# Altium project shoot2.PrjPcb
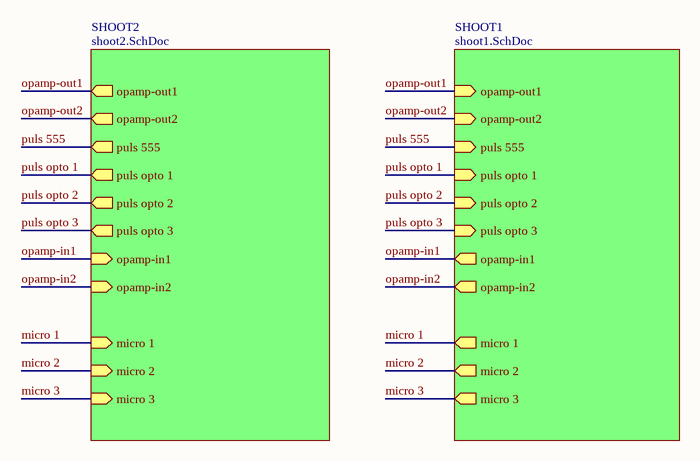
[diagram p0: mainsheet.SchDoc]
3 sheets, 80 parts. Net scope: hierarchical (ports join the sheet entries above them; power ports are global).
Board file: PCB1.PcbDoc
Sheets:
  mainsheet.SchDoc
    SHOOT2 = shoot2.SchDoc
    SHOOT1 = shoot1.SchDoc

## Sheet mainsheet.SchDoc
size A

### Sub-sheets
SHOOT1 = shoot1.SchDoc: opamp-out1 (in), opamp-out2 (in), puls 555 (in), puls opto 1 (in), puls opto 2 (in), puls opto 3 (in), opamp-in1 (out), opamp-in2 (out), micro 1 (out), micro 2 (out), micro 3 (out)
SHOOT2 = shoot2.SchDoc: opamp-out1 (out), opamp-out2 (out), puls 555 (out), puls opto 1 (out), puls opto 2 (out), puls opto 3 (out), opamp-in1 (in), opamp-in2 (in), micro 1 (in), micro 2 (in), micro 3 (in)

### Nets
micro 1: sheet SHOOT2/micro 1, sheet SHOOT1/micro 1
micro 2: sheet SHOOT2/micro 2, sheet SHOOT1/micro 2
micro 3: sheet SHOOT2/micro 3, sheet SHOOT1/micro 3
opamp-in1: sheet SHOOT2/opamp-in1, sheet SHOOT1/opamp-in1
opamp-in2: sheet SHOOT2/opamp-in2, sheet SHOOT1/opamp-in2
opamp-out1: sheet SHOOT2/opamp-out1, sheet SHOOT1/opamp-out1
opamp-out2: sheet SHOOT2/opamp-out2, sheet SHOOT1/opamp-out2
puls 555: sheet SHOOT2/puls 555, sheet SHOOT1/puls 555
puls opto 1: sheet SHOOT2/puls opto 1, sheet SHOOT1/puls opto 1
puls opto 2: sheet SHOOT2/puls opto 2, sheet SHOOT1/puls opto 2
puls opto 3: sheet SHOOT2/puls opto 3, sheet SHOOT1/puls opto 3

## Sheet shoot2.SchDoc
size A
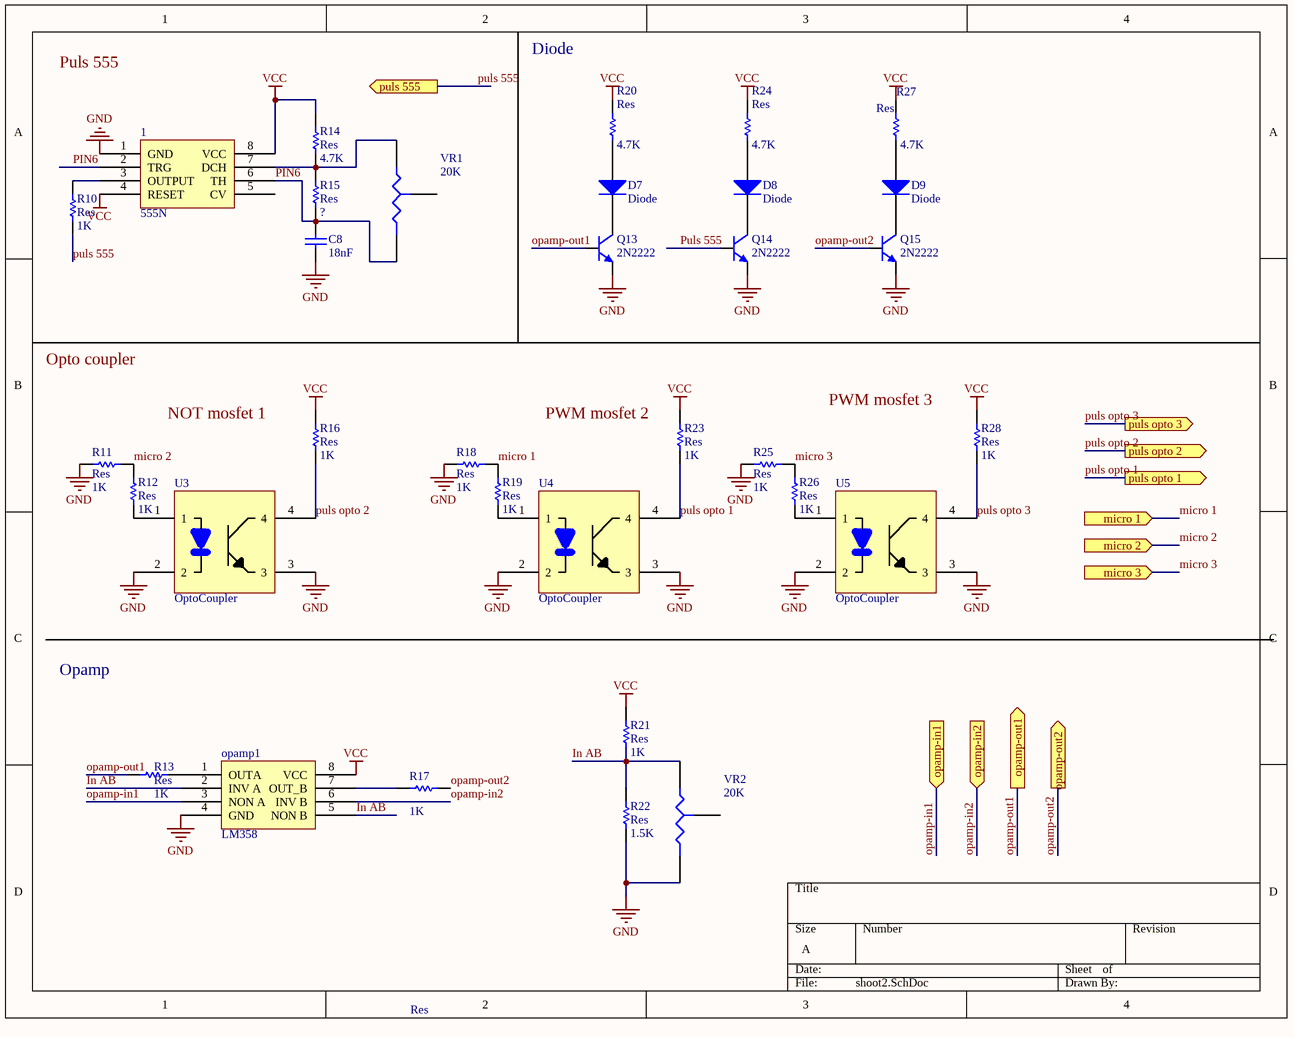
[diagram p1: shoot2.SchDoc]

### Parts
1  555N  [8 pin SOIC_N]
C8  value 18nF  [2012[0805]]  (hidden comment: Cap_UP)
D7  Diode  [2012[0805]]
D8  Diode  [2012[0805]]
D9  Diode  [2012[0805]]
opamp1  LM358  [8 pin SOIC_N]
Q13  2N2222  [SOT-23]
Q14  2N2222  [SOT-23]
Q15  2N2222  [SOT-23]
R10  Res  value 1K  [2012[0805]]
R11  Res  value 1K  [2012[0805]]
R12  Res  value 1K  [2012[0805]]
R13  Res  value 1K  [2012[0805]]
R14  Res  value 4.7K  [2012[0805]]
R15  Res  [2012[0805]]
R16  Res  value 1K  [2012[0805]]
R17  Res  value 1K  [2012[0805]]
R18  Res  value 1K  [2012[0805]]
R19  Res  value 1K  [2012[0805]]
R20  Res  value 4.7K  [2012[0805]]
R21  Res  value 1K  [2012[0805]]
R22  Res  value 1.5K  [2012[0805]]
R23  Res  value 1K  [2012[0805]]
R24  Res  value 4.7K  [2012[0805]]
R25  Res  value 1K  [2012[0805]]
R26  Res  value 1K  [2012[0805]]
R27  Res  value 4.7K  [2012[0805]]
R28  Res  value 1K  [2012[0805]]
U3  OptoCoupler  [DIP-4]
U4  OptoCoupler  [DIP-4]
U5  OptoCoupler  [DIP-4]
VR1  value 20K  [MULTITURN]  (hidden comment: Res Tap)
VR2  value 20K  [MULTITURN]  (hidden comment: Res Tap)

### Ports
micro 1 (in), micro 2 (in), micro 3 (in), opamp-in1 (in), opamp-in2 (in), opamp-out1 (out), opamp-out2 (out), puls 555 (out), puls opto 1 (out), puls opto 2 (out), puls opto 3 (out)

### Nets
GND: 1.1(GND) C8.2 opamp1.4(GND) Q13.3(E) Q14.3(E) Q15.3(E) R11.2 R18.2 R22.1 R25.2 U3.2 U3.3 U4.2 U4.3 U5.2 U5.3 VR2.2(B)
VCC: 1.4(RESET) 1.8(VCC) opamp1.8(VCC) R14.2 R16.2 R20.2 R21.2 R23.2 R24.2 R27.2 R28.2
In AB: opamp1.2(INV_A) opamp1.5(NON_B) R21.1 R22.2 VR2.1(A)
micro 1: R18.1 R19.2 ; port micro 1
micro 2: R11.1 R12.2 ; port micro 2
micro 3: R25.1 R26.2 ; port micro 3
opamp-in1: opamp1.3(NON_A) ; port opamp-in1
opamp-in2: opamp1.6(INV_B) ; port opamp-in2
opamp-out1: Q13.2(B) R13.2 ; port opamp-out1
opamp-out2: Q15.2(B) R17.1 ; port opamp-out2
PIN6: 1.2(TRG) 1.6(TH) C8.1 R15.1 VR1.2(B)
puls 555: Q14.2(B) R10.1 ; port puls 555
puls opto 1: R23.1 U4.4 ; port puls opto 1
puls opto 2: R16.1 U3.4 ; port puls opto 2
puls opto 3: R28.1 U5.4 ; port puls opto 3
Net1_3: 1.3(OUTPUT) R10.2
Net1_7: 1.7(DCH) R14.1 R15.2 VR1.1(A)
NetD7_1: D7.1(A) R20.1
NetD7_2: D7.2(K) Q13.1(C)
NetD8_1: D8.1(A) R24.1
NetD8_2: D8.2(K) Q14.1(C)
NetD9_1: D9.1(A) R27.1
NetD9_2: D9.2(K) Q15.1(C)
Netopamp1_1: opamp1.1(OUTA) R13.1
Netopamp1_7: opamp1.7(OUT_B) R17.2
NetR12_1: R12.1 U3.1
NetR19_1: R19.1 U4.1
NetR26_1: R26.1 U5.1

Not connected (* = marked no-connect by the designer): 1 5(CV); VR1 3(TAP); VR2 3(TAP)

### Notes on the sheet
- Diode
- Opamp
- Labels drawn without touching a wire or pin: NOT mosfet 1, Opto coupler, Puls 555, PWM mosfet 2, PWM mosfet 3

### Library data of the parts
1 opamp1 = 7667: Dual MOSFET Driver
C8 = Cap_UP: Capacitor; Published: 8-Jun-2000; LatestRevisionDate: 17-Jul-2002; LatestRevisionNote: Re-released for DXP Platform.; PackageReference: RAD-0.3; Publisher: Altium Limited
D7-D9 = Diode: 1 Amp General Purpose Rectifier; Revision 1: 11-Jul-2000: SIM Model Added.; Revision 2: 17-Jul-2002: Re-released for DXP Platform.; Package Information: Latest Revision: Aug-1999; Code - JEDEC: DO-204-AL; Published: 8-Jun-2000; Datasheet: Latest Revision: 1998; Package Reference: DO-41; Publisher: Altium Limited
Q13-Q15 = 2N2222: NPN Bipolar Transistor; Published: 8-Jun-2000; LatestRevisionDate: 17-Jul-2002; LatestRevisionNote: Re-released for DXP Platform.; PackageReference: TO-226; Publisher: Altium Limited; Code_JEDEC: TO-226-AA
R10-R28 = Res: Semiconductor Resistor; Published: 8-Jun-2000; LatestRevisionDate: 17-Jul-2002; LatestRevisionNote: Re-released for DXP Platform.; PackageReference: AXIAL-0.5; Publisher: Altium Limited
  R15: Value: ?
U3-U5 = TLP521
VR1 VR2 = Res Tap: Tapped Resistor; Sim Note: Enter the Resistance value and the set point into parameter fields.; Set Position: 0.5; Published: 24-Mar-1999; LatestRevisionDate: 17-Jul-2002; LatestRevisionNote: Re-released for DXP Platform.; PackageReference: VR3; Publisher: Altium Limited

## Sheet shoot1.SchDoc
size A
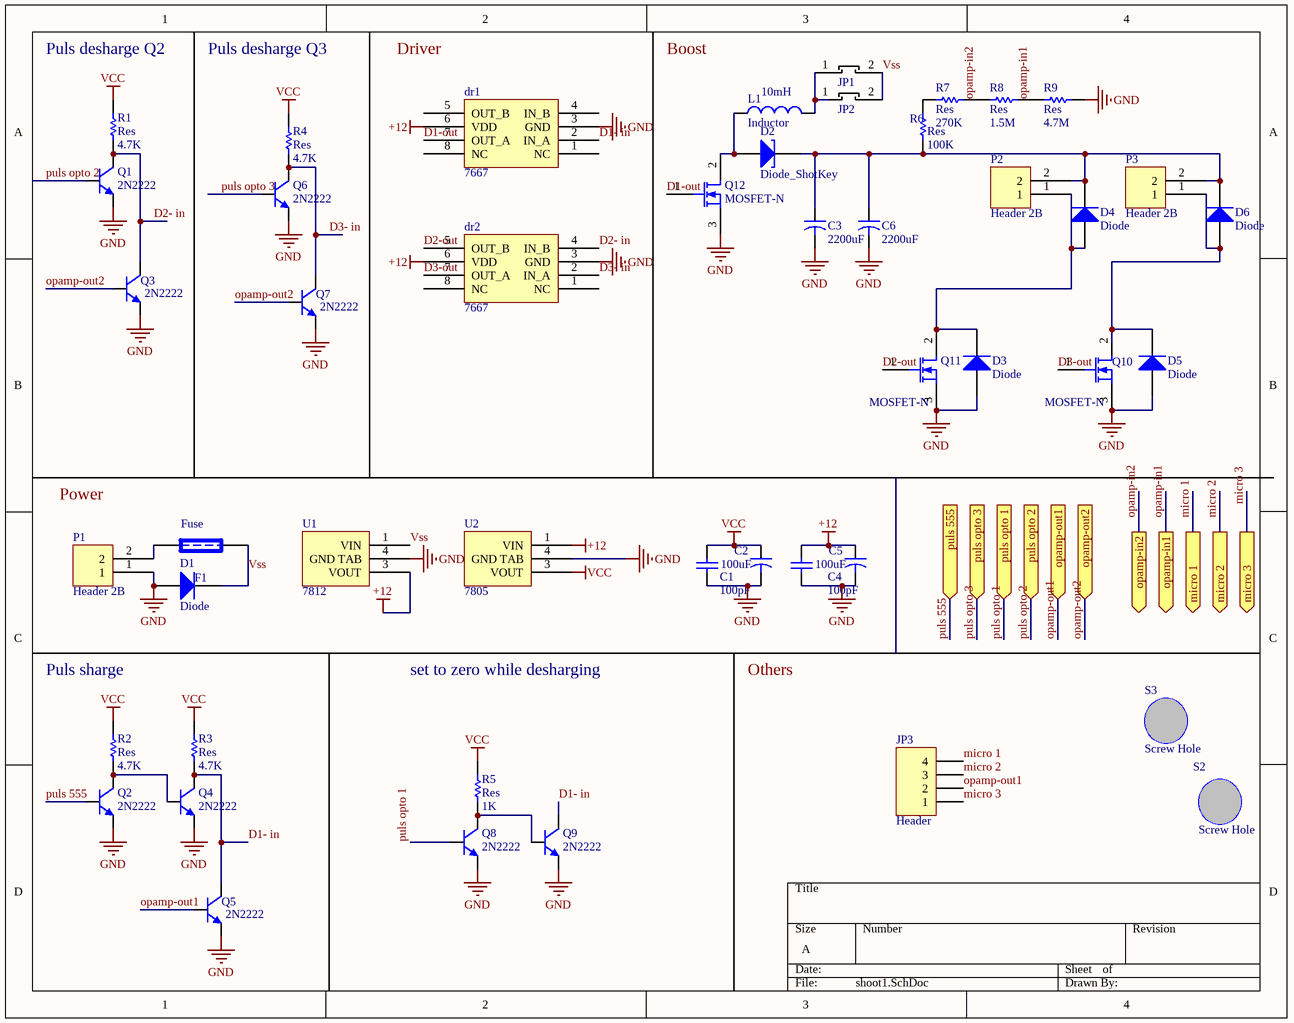
[diagram p2: shoot1.SchDoc]

### Parts
C1  value 100pF  [2012[0805]]  (hidden comment: Cap_UP)
C2  value 100uF  [EL_M]  (hidden comment: Cap_El)
C3  value 2200uF  [CAP]  (hidden comment: Cap_El_200V)
C4  value 100pF  [2012[0805]]  (hidden comment: Cap_UP)
C5  value 100uF  [EL_M]  (hidden comment: Cap_El)
C6  value 2200uF  [CAP]  (hidden comment: Cap_El_200V)
D1  Diode  [US1M]
D2  Diode_ShotKey  [TO-220A - duplicate]
D3  Diode  [DIO10.46-5.3X2.8]
D4  Diode  [DIO10.46-5.3X2.8]
D5  Diode  [DIO10.46-5.3X2.8]
D6  Diode  [DIO10.46-5.3X2.8]
dr1  7667  [8 pin SOIC_M]
dr2  7667  [8 pin SOIC_M]
F1  Fuse  [fuse new]
JP1  JUMPER  [JPR]  (value not drawn)
JP2  JUMPER  [JPR]  (value not drawn)
JP3  Header  [sucket-smd-4pin]
L1  Inductor  value 10mH  [mh2]
P1  Header 2B  [BHDR1X2]
P2  Header 2B  [BHDR1X2]
P3  Header 2B  [BHDR1X2]
Q1  2N2222  [SOT-23]
Q2  2N2222  [SOT-23]
Q3  2N2222  [SOT-23]
Q4  2N2222  [SOT-23]
Q5  2N2222  [SOT-23]
Q6  2N2222  [SOT-23]
Q7  2N2222  [SOT-23]
Q8  2N2222  [SOT-23]
Q9  2N2222  [SOT-23]
Q10  MOSFET-N  [TO247]
Q11  MOSFET-N  [TO247]
Q12  MOSFET-N  [TO247]
R1  Res  value 4.7K  [2012[0805]]
R2  Res  value 4.7K  [2012[0805]]
R3  Res  value 4.7K  [2012[0805]]
R4  Res  value 4.7K  [2012[0805]]
R5  Res  value 1K  [2012[0805]]
R6  Res  value 100K  [2012[0805]]
R7  Res  value 270K  [2012[0805]]
R8  Res  value 1.5M  [2012[0805]]
R9  Res  value 4.7M  [2012[0805]]
S2  Screw Hole  [Screw Holw 3-6 mm]
S3  Screw Hole  [Screw Holw 3-6 mm]
U1  7812  [D-PACK]
U2  7805  [D-PACK]

### Ports
micro 1 (out), micro 2 (out), micro 3 (out), opamp-in1 (out), opamp-in2 (out), opamp-out1 (in), opamp-out2 (in), puls 555 (in), puls opto 1 (in), puls opto 2 (in), puls opto 3 (in)

### Nets
+12: C4.2 C5.1 dr1.6(VDD) dr2.6(VDD) U1.3(VOUT) U2.1(VIN)
GND: C1.1 C2.2 C3.2 C4.1 C5.2 C6.2 D1.1(A) D3.1(A) D5.1(A) dr1.3(GND) dr2.3(GND) P1.1 Q1.3(E) Q2.3(E) Q3.3(E) Q4.3(E) Q5.3(E) Q6.3(E) Q7.3(E) Q8.3(E) Q9.3(E) Q10.3(S) Q11.3(S) Q12.3(S) R9.1 U1.4(GND_TAB) U2.4(GND_TAB)
VCC: C1.2 C2.1 R1.2 R2.2 R3.2 R4.2 R5.2 U2.3(VOUT)
D1- in: dr1.2(IN_A) Q4.1(C) Q5.1(C) Q9.1(C) R3.1
D1-out: dr1.7(OUT_A) Q12.1(G)
D2- in: dr2.4(IN_B) Q1.1(C) Q3.1(C) R1.1
D2-out: dr2.5(OUT_B) Q11.1(G)
D3- in: dr2.2(IN_A) Q6.1(C) Q7.1(C) R4.1
D3-out: dr2.7(OUT_A) Q10.1(G)
micro 1: JP3.4 ; port micro 1
micro 2: JP3.3 ; port micro 2
micro 3: JP3.1 ; port micro 3
opamp-in1: R8.1 R9.2 ; port opamp-in1
opamp-in2: R7.1 R8.2 ; port opamp-in2
opamp-out1: JP3.2 Q5.2(B) ; port opamp-out1
opamp-out2: Q3.2(B) Q7.2(B) ; port opamp-out2
puls 555: Q2.2(B) ; port puls 555
puls opto 1: Q8.2(B) ; port puls opto 1
puls opto 2: Q1.2(B) ; port puls opto 2
puls opto 3: Q6.2(B) ; port puls opto 3
Vss: D1.2(K) F1.2 JP1.2 JP2.2 U1.1(VIN)
NetC3_1: C3.1 C6.1 D2.1(K) D4.2(K) D6.2(K) P2.2 P3.2 R6.1
NetD2_2: D2.2(A) L1.1 Q12.2(D)
NetD3_2: D3.2(K) D4.1(A) P2.1 Q11.2(D)
NetD5_2: D5.2(K) D6.1(A) P3.1 Q10.2(D)
NetF1_1: F1.1 P1.2
NetJP1_1: JP1.1 JP2.1 L1.2
NetQ2_1: Q2.1(C) Q4.2(B) R2.1
NetQ8_1: Q8.1(C) Q9.2(B) R5.1
NetR6_2: R6.2 R7.2

Not connected (* = marked no-connect by the designer): dr1 1(NC) 4(IN_B) 5(OUT_B) 8(NC); dr2 1(NC) 8(NC)

### Notes on the sheet
- Puls desharge Q2
- Puls desharge Q3
- Puls sharge
- set to zero while desharging
- Labels drawn without touching a wire or pin: Boost, Driver, Others, Power

### Library data of the parts
C1 C4 = Cap_UP: Capacitor; Published: 8-Jun-2000; LatestRevisionDate: 17-Jul-2002; LatestRevisionNote: Re-released for DXP Platform.; PackageReference: RAD-0.3; Publisher: Altium Limited
C2 C5 = Cap_El: Capacitor; Published: 23-Sep-2002; PackageReference: CAPR5-4X5; Publisher: Altium Limited
C3 C6 = Cap_El_200V: Capacitor; Published: 23-Sep-2002; PackageReference: CAPR5-4X5; Publisher: Altium Limited
D1 D3-D6 = Diode: as D7 on sheet shoot2; Published: 8-Jun-2000; Datasheet: Latest Revision: 1998; Package Reference: DO-41; Publisher: Altium Limited
D2 = Diode_ShotKey: 1 Amp General Purpose Rectifier; Revision 1: 11-Jul-2000: SIM Model Added.; Revision 2: 17-Jul-2002: Re-released for DXP Platform.; Package Information: Latest Revision: Aug-1999; Code - JEDEC: DO-204-AL; Published: 8-Jun-2000; Datasheet: Latest Revision: 1998; Package Reference: DO-41; Publisher: Altium Limited
dr1 dr2 = 7667: Dual MOSFET Driver
JP3 = Header 4: Header, 4-Pin; LatestRevisionDate: 17-Jul-2002; LatestRevisionNote: Re-released for DXP Platform.; Publisher: Altium Limited
L1 = Inductor: Code_IEC: 1005; Published: 8-Jun-2000; LatestRevisionDate: 17-Jul-2002; LatestRevisionNote: Re-released for DXP Platform.; PackageReference: 0402-A; Publisher: Altium Limited; Code_JEITA: 0402
Q1-Q9 = 2N2222: NPN Bipolar Transistor; Published: 8-Jun-2000; LatestRevisionDate: 17-Jul-2002; LatestRevisionNote: Re-released for DXP Platform.; PackageReference: TO-226; Publisher: Altium Limited; Code_JEDEC: TO-226-AA
Q10-Q12 = MOSFET-N: N-Channel MOSFET; PackageDocument: 1995/1996; Published: 8-Jun-2000; LatestRevisionDate: 17-Jul-2002; LatestRevisionNote: Re-released for DXP Platform.; PackageReference: E3; Publisher: Altium Limited
R1-R9 = Res: Semiconductor Resistor; Published: 8-Jun-2000; LatestRevisionDate: 17-Jul-2002; LatestRevisionNote: Re-released for DXP Platform.; PackageReference: AXIAL-0.5; Publisher: Altium Limited
F1 = Fuse: Published: 8-Jun-2000; LatestRevisionDate: 17-Jul-2002; LatestRevisionNote: Re-released for DXP Platform.; PackageReference: PIN-W2/E2.8; Publisher: Altium Limited

## Nets that join several sheets
GND: shoot2 (17 pins), shoot1 (27 pins)
VCC: shoot2 (11 pins), shoot1 (8 pins)
micro 1: shoot2 (R18.1 R19.2), shoot1 (JP3.4)
micro 2: shoot2 (R11.1 R12.2), shoot1 (JP3.3)
micro 3: shoot2 (R25.1 R26.2), shoot1 (JP3.1)
opamp-in1: shoot2 (opamp1.3), shoot1 (R8.1 R9.2)
opamp-in2: shoot2 (opamp1.6), shoot1 (R7.1 R8.2)
opamp-out1: shoot2 (Q13.2 R13.2), shoot1 (JP3.2 Q5.2)
opamp-out2: shoot2 (Q15.2 R17.1), shoot1 (Q3.2 Q7.2)
puls 555: shoot2 (Q14.2 R10.1), shoot1 (Q2.2)
puls opto 1: shoot2 (R23.1 U4.4), shoot1 (Q8.2)
puls opto 2: shoot2 (R16.1 U3.4), shoot1 (Q1.2)
puls opto 3: shoot2 (R28.1 U5.4), shoot1 (Q6.2)